# EAGLE schematic tradfri_ICC-1 (EAGLE 9.6.2)
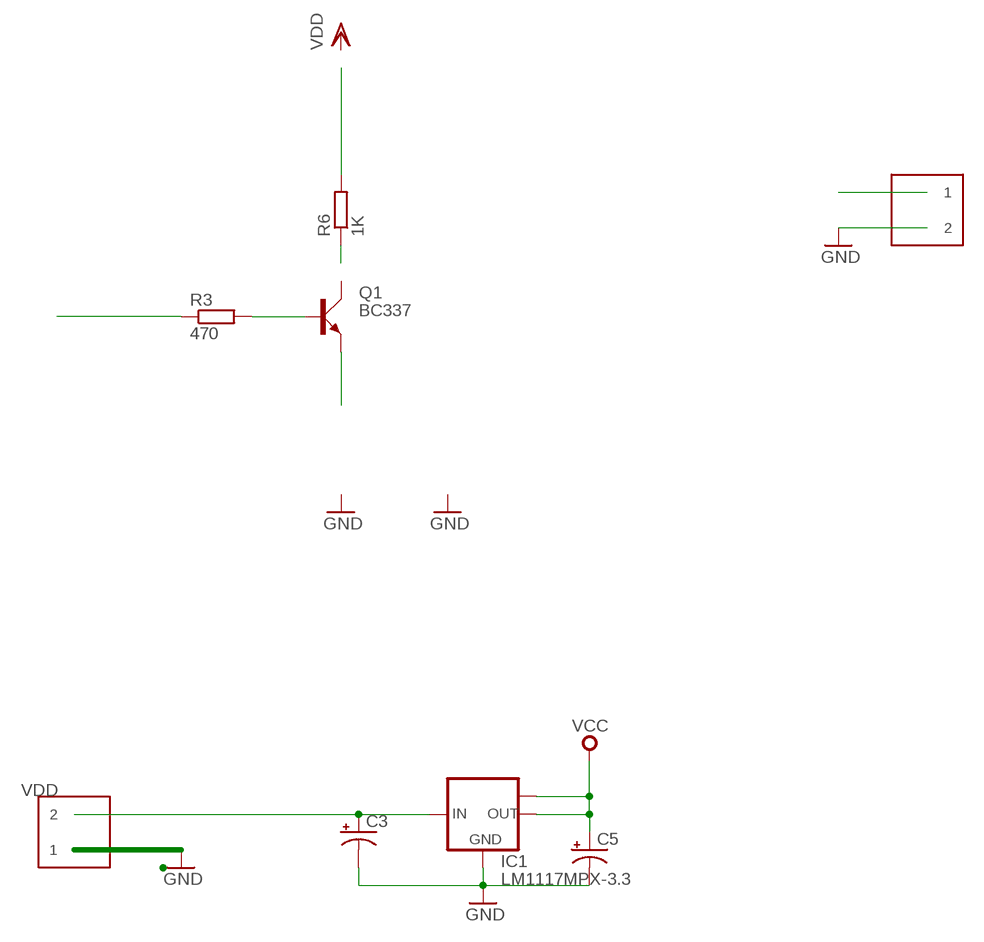
[diagram p0: schematic, sheet 1]

## Parts
C3  100UF-25V-20%(PTH)  [CPOL-RADIAL-100UF-25V]
C5  100UF-25V-20%(PTH)  [CPOL-RADIAL-100UF-25V]
IC1  LM1117MPX-3.3  [SOT223]
PWR_IN  KF350-P2  [KF350-2P]
Q1  BC337  [SOT54A]
R3  470  R-EU_R0805  [R0805]
R6  1K  R-EU_R0805  [R0805]
U$3  KF350-P2  [KF350-2P]

## Nets
+3V3: C5.1(+) IC1.2(OUT) IC1.TAB(OUT1) ; supply symbol labelled VCC
GND: C3.2(-) C5.2(-) IC1.1(GND) PWR_IN.1 U$3.2
N$1: Q1.B R3.2
N$2: R6.1
N$5: Q1.E
N$8: R3.1
N$11: U$3.1
VDD: C3.1(+) IC1.3(IN) PWR_IN.2 R6.2
Unconnected: Q1.C

## Library data of the parts
C3 C5 = SparkFun-Capacitors:100UF-25V-20%(PTH): CAP-08439; PROD_ID: CAP-08439
IC1 = lm1117:LM1117MPX-*
PWR_IN U$3 = KF350-P2:KF350-P2
Q1 = transistor-small-signal:BC337: NPN TRANSISTOR
R3 R6 = resistor:R-EU_: RESISTOR, European symbol

## Net classes
1 +3v3: width 0.406 mm
2 GND: width 0.406 mm